# EAGLE design CatPlay (EAGLE 9.4.0)
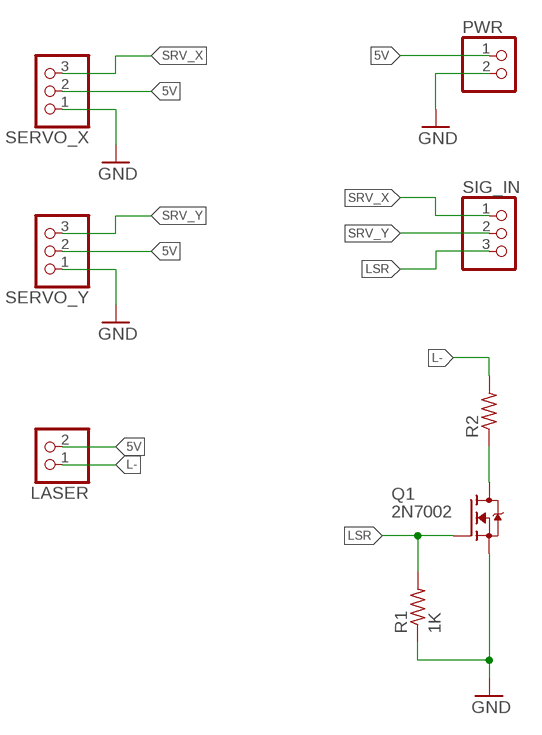
[diagram p0: schematic, sheet 1]

## Parts
LASER  PINHD-1X2  [1X02]
PWR  PINHD-1X2  [1X02]
Q1  2N7002  [SOT-23]
R1  1K  R-US_R0603  [R0603]
R2  R-US_R0603  [R0603]
SERVO_X  PINHD-1X3  [1X03]
SERVO_Y  PINHD-1X3  [1X03]
SIG_IN  PINHD-1X3  [1X03]

## Nets
5V: LASER.2 PWR.1 SERVO_X.2 SERVO_Y.2
GND: PWR.2 Q1.2(S) R1.1 SERVO_X.1 SERVO_Y.1
L-: LASER.1 R2.2
LSR: Q1.1(G) R1.2 SIG_IN.3
N$3: Q1.3(D) R2.1
SRV_X: SERVO_X.3 SIG_IN.1
SRV_Y: SERVO_Y.3 SIG_IN.2

## Library data of the parts
LASER PWR = pinhead:PINHD-1X2: PIN HEADER
Q1 = CatPlay:2N7002: 2N7002 N-channel MOSFET https://www.digikey.com/product-detail/en/nexperia-usa-inc/2N7002NXAKR/1727-8643-1-ND/10416560 OVERVIEW N-channel enhancement mode Field-Effect Transistor (FET) in a small SOT23 (TO-236AB) Surface-Mounted Device (SMD) plastic package using Trench MOSFET technology.
R1 R2 = rcl:R-US_: RESISTOR, American symbol; SPICEPREFIX: R
SERVO_X SERVO_Y SIG_IN = pinhead:PINHD-1X3: PIN HEADER

## Board
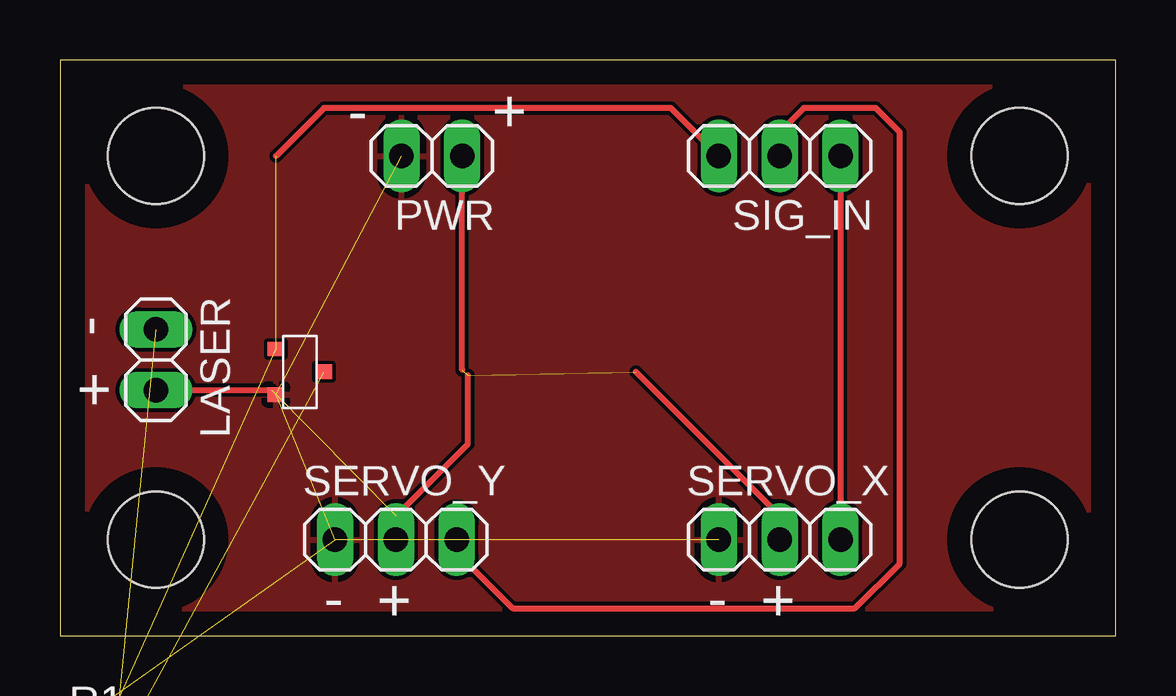
[diagram p1: board, top side]
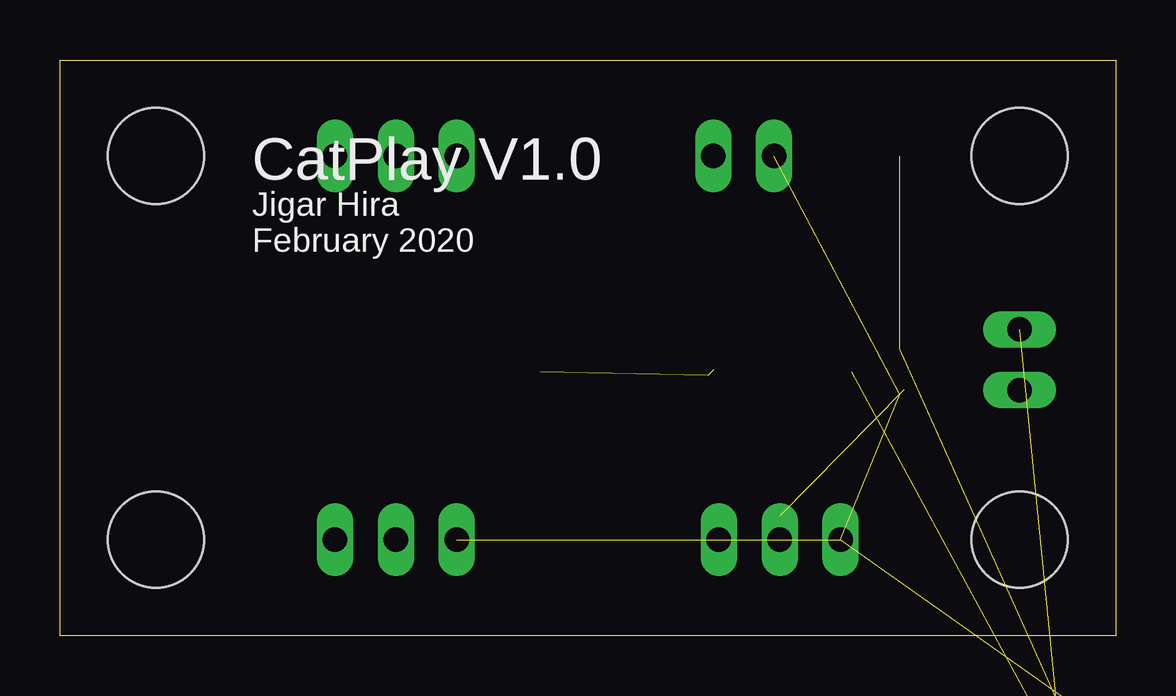
[diagram p2: board, bottom side, seen from below]

Size 44 x 24 mm. Coordinates in mm from the lower left corner, seen from the top.
Outline: 0,0 44,0 44,24 0,24 0,0
Copper layers (1*16): Top 0.035mm / dielectric 1.5mm / Bottom 0.035mm
Design rules "default": minimum track width 6mil, minimum drill 0.35mm, track to track 6mil, track to pad 6mil, pad to pad 6mil, via to via 6mil, smd to smd 6mil, copper to edge 40mil, drill to drill 6mil, minimum pad ring 10mil, minimum via ring 8mil, stop-mask expansion 4mil, vias tented up to drill 0mil, thermal gap 10mil
Holes 4 mm at 4,4 4,20 40,20 40,4

### Footprints (pad centres in the part's own frame; a part is rotated, then mirrored left to right if it is on the bottom)
1X02 = drill 1.016 long: 1 -1.27,0; 2 1.27,0
SOT-23 = smd 0.6 x 0.7: 1 0.95,1; 2 -0.95,1; 3 0,-1
R0603 = smd 1 x 1.1: 1 -0.85,0; 2 0.85,0
1X03 = drill 1.016 long: 1 -2.54,0; 2 0,0; 3 2.54,0

### Placement (x,y rotation side)
LASER  4,11.5 270 top
PWR  15.5,20 180 top
Q1  10,11 90 top
R1  1,-4 0 top  (outside the outline)
R2  1,-9 0 top  (outside the outline)
SERVO_X  30,4 0 top
SERVO_Y  14,4 0 top
SIG_IN  30,20 180 top

### Tracks (layer width: path | path; a pad name or v marks a point on that pad's centre or on a via)
5V  (3 unrouted)
  Top 0.254: 16.77,11.08 PWR.1 | SERVO_Y.2 14,5 17,8 17,10.85 | SERVO_X.2 30,5 24,11 | LASER.2 8.82,10.23
GND  (4 unrouted)
  pour Top: -1,25 45,25 45,-1 -1,-1
L-  (1 unrouted)
LSR  (2 unrouted)
  Top 0.254: SIG_IN.3 25.46,22 11,22 9,20
N$3  (1 unrouted)
SRV_X
  Top 0.254: SIG_IN.1 SERVO_X.3
SRV_Y
  Top 0.254: SERVO_Y.3 16.54,3.46 18.86,1.14 33.14,1.14 35,3 35,21 34,22 31,22 30,21 SIG_IN.2

### Text on the board
tPlace: - | + | - | + | - | + | - | +
bPlace: CatPlay V1.0 | Jigar Hira / February 2020